# Altium schematic sheet isolated_USB.SchDoc: foxBMS BMS-Master
size A3; DocumentNumber: 19; SheetNumber: 19; SheetTotal: 24; Author: Fraunhofer IISB foxBMS Team; REL-DATE: 2017-05-16; VERSION: 1.0.2; SheetDescription: Isolated USB MCU_0 + MCU_1
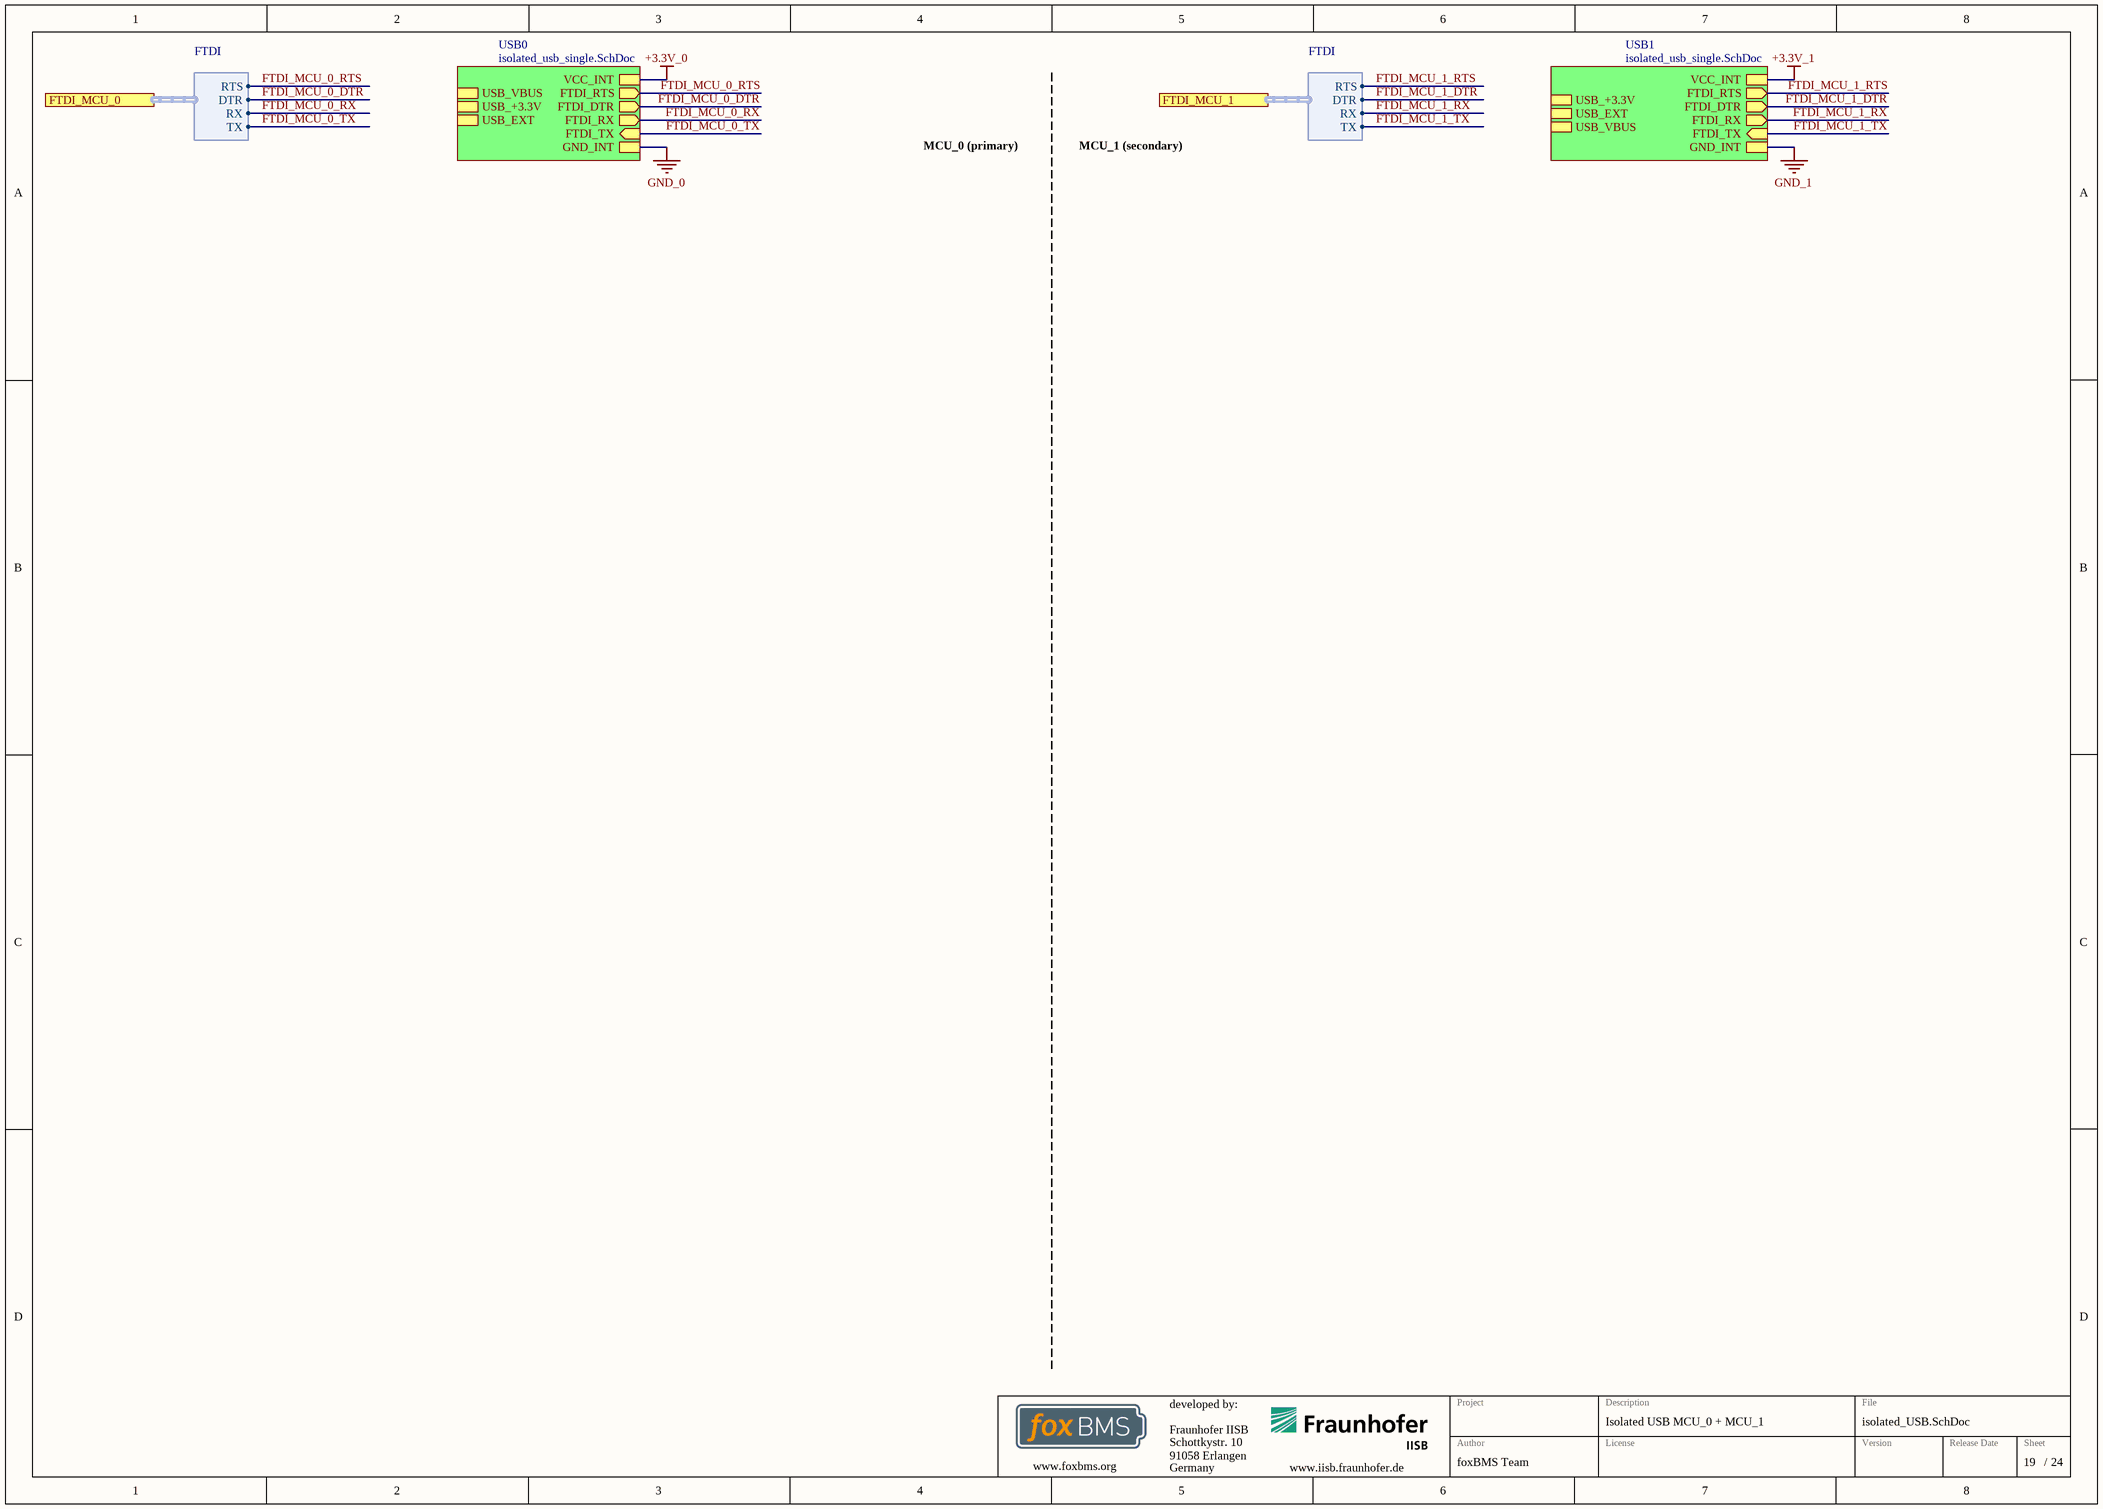
[diagram p0: isolated_USB.SchDoc]

## Sub-sheets
USB0 = isolated_usb_single.SchDoc: FTDI_TX (in), FTDI_RX (out), FTDI_DTR (out), FTDI_RTS (out), VCC_INT, GND_INT, USB_VBUS, USB_+3.3V, USB_EXT
USB1 = isolated_usb_single.SchDoc: FTDI_TX (in), FTDI_RX (out), FTDI_DTR (out), FTDI_RTS (out), VCC_INT, GND_INT, USB_+3.3V, USB_EXT, USB_VBUS

## Ports
FTDI_MCU_0 (harness FTDI), FTDI_MCU_1 (harness FTDI)

## Harnesses
FTDI: RTS, DTR, RX, TX

## Nets
+3.3V_0: sheet USB0/VCC_INT
+3.3V_1: sheet USB1/VCC_INT
GND_0: sheet USB0/GND_INT
GND_1: sheet USB1/GND_INT
FTDI_MCU_0_DTR: sheet USB0/FTDI_DTR, port FTDI_MCU_0.DTR
FTDI_MCU_0_RTS: sheet USB0/FTDI_RTS, port FTDI_MCU_0.RTS
FTDI_MCU_0_RX: sheet USB0/FTDI_RX, port FTDI_MCU_0.RX
FTDI_MCU_0_TX: sheet USB0/FTDI_TX, port FTDI_MCU_0.TX
FTDI_MCU_1_DTR: sheet USB1/FTDI_DTR, port FTDI_MCU_1.DTR
FTDI_MCU_1_RTS: sheet USB1/FTDI_RTS, port FTDI_MCU_1.RTS
FTDI_MCU_1_RX: sheet USB1/FTDI_RX, port FTDI_MCU_1.RX
FTDI_MCU_1_TX: sheet USB1/FTDI_TX, port FTDI_MCU_1.TX

## Notes on the sheet
- MCU_0 (primary)
- MCU_1 (secondary)
- Fraunhofer IISB
- Schottkystr. 10
- developed by:
- 91058 Erlangen
- Germany
- Author
- Project
- License
- Description
- File
- Version
- Release Date
- Sheet
- www.foxbms.org
- www.iisb.fraunhofer.de
- foxBMS Team
- /